# Altium schematic sheet Mircod_TEST_LIST_2.SchDoc
size A4
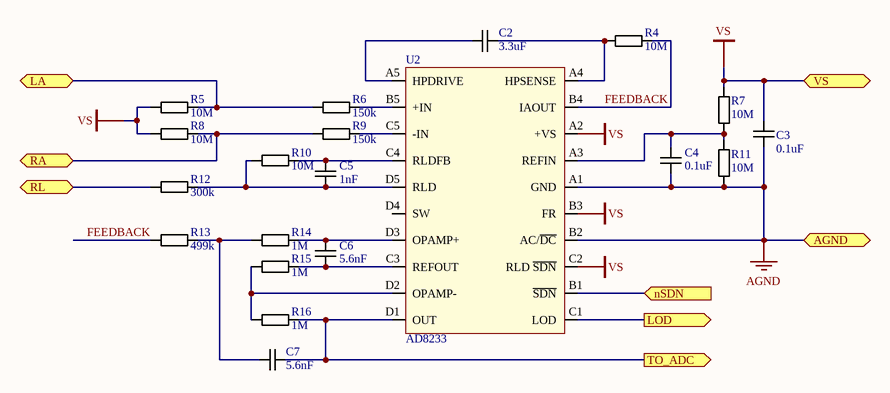
[diagram p0: Mircod_TEST_LIST_2.SchDoc]

## Parts
C2  3.3uF  [Csmd_0402]
C3  0.1uF  [Csmd_0402]
C4  0.1uF  [Csmd_0402]
C5  1nF  [Csmd_0402]
C6  5.6nF  [Csmd_0402]
C7  5.6nF  [Csmd_0402]
R4  10M  [SMD_0402]
R5  10M  [SMD_0402]
R6  150k  [SMD_0402]
R7  10M  [SMD_0402]
R8  10M  [SMD_0402]
R9  150k  [SMD_0402]
R10  10M  [SMD_0402]
R11  10M  [SMD_0402]
R12  300k  [SMD_0402]
R13  499k  [SMD_0402]
R14  1M  [SMD_0402]
R15  1M  [SMD_0402]
R16  1M  [SMD_0402]
U2  AD8233  [CB-20-13]

## Ports
AGND (bidir), LA, LOD (out), nSDN (in), RA, RL, TO_ADC (out), VS (bidir)

## Nets
AGND: C3.1 C4.1 R11.1 U2.A1(GND) U2.B2(AC/~{DC}) ; port AGND
VS: C3.2 R5.1 R7.2 R8.1 U2.A2(+VS) U2.B3(FR) U2.C2(RLD_~{SDN}) ; port VS
FEEDBACK: R4.2 R13.1 U2.B4(IAOUT)
LA: R5.2 R6.1 ; port LA
LOD: U2.C1(LOD) ; port LOD
nSDN: U2.B1(~{SDN}) ; port nSDN
RA: R8.2 R9.1 ; port RA
RL: R12.1 ; port RL
TO_ADC: C7.1 R16.2 U2.D1(OUT) ; port TO_ADC
NetC2_1: C2.1 U2.A5(HPDRIVE)
NetC2_2: C2.2 R4.1 U2.A4(HPSENSE)
NetC4_2: C4.2 R7.1 R11.2 U2.A3(REFIN)
NetC5_1: C5.1 R10.1 R12.2 U2.D5(RLD)
NetC5_2: C5.2 R10.2 U2.C4(RLDFB)
NetC6_1: C6.1 R15.2 U2.C3(REFOUT)
NetC6_2: C6.2 R14.2 U2.D3(OPAMP+)
NetC7_2: C7.2 R13.2 R14.1
NetR6_2: R6.2 U2.B5(+IN)
NetR9_2: R9.2 U2.C5(-IN)
NetR15_1: R15.1 R16.1 U2.D2(OPAMP-)

Not connected (* = marked no-connect by the designer): U2 D4(SW)

## Library data of the parts
C2-C7 = C_SMD: CAPACITOR
R4-R16 = R_SMD: RESISTOR
U2 = AD8233: Low Noise,  Heart Rate Monitor for Wearable Products